# EasyEDA Pro project ProDoc_PCB_SAMID_2026-04-18.epro

# Board PCB_SAMID
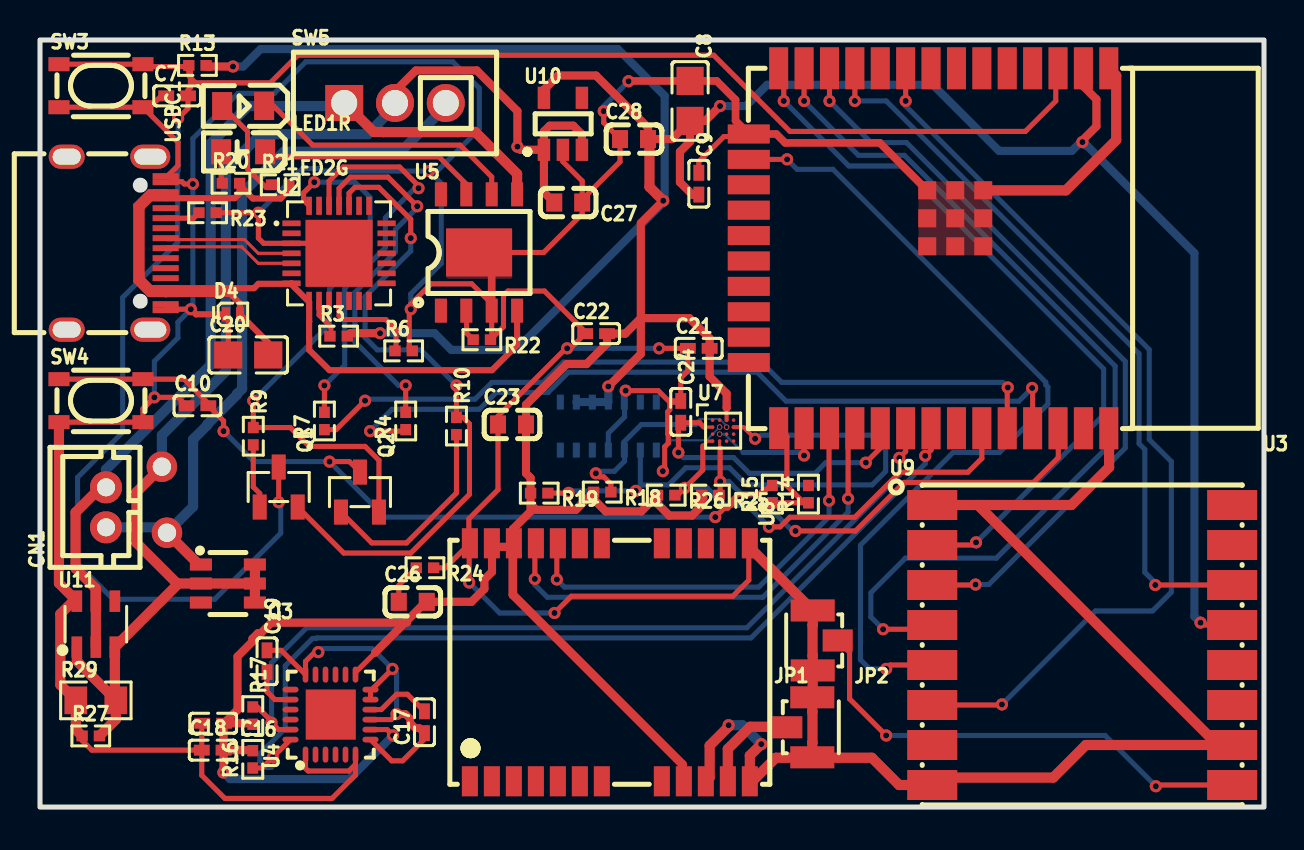
[diagram p0: board, top side]
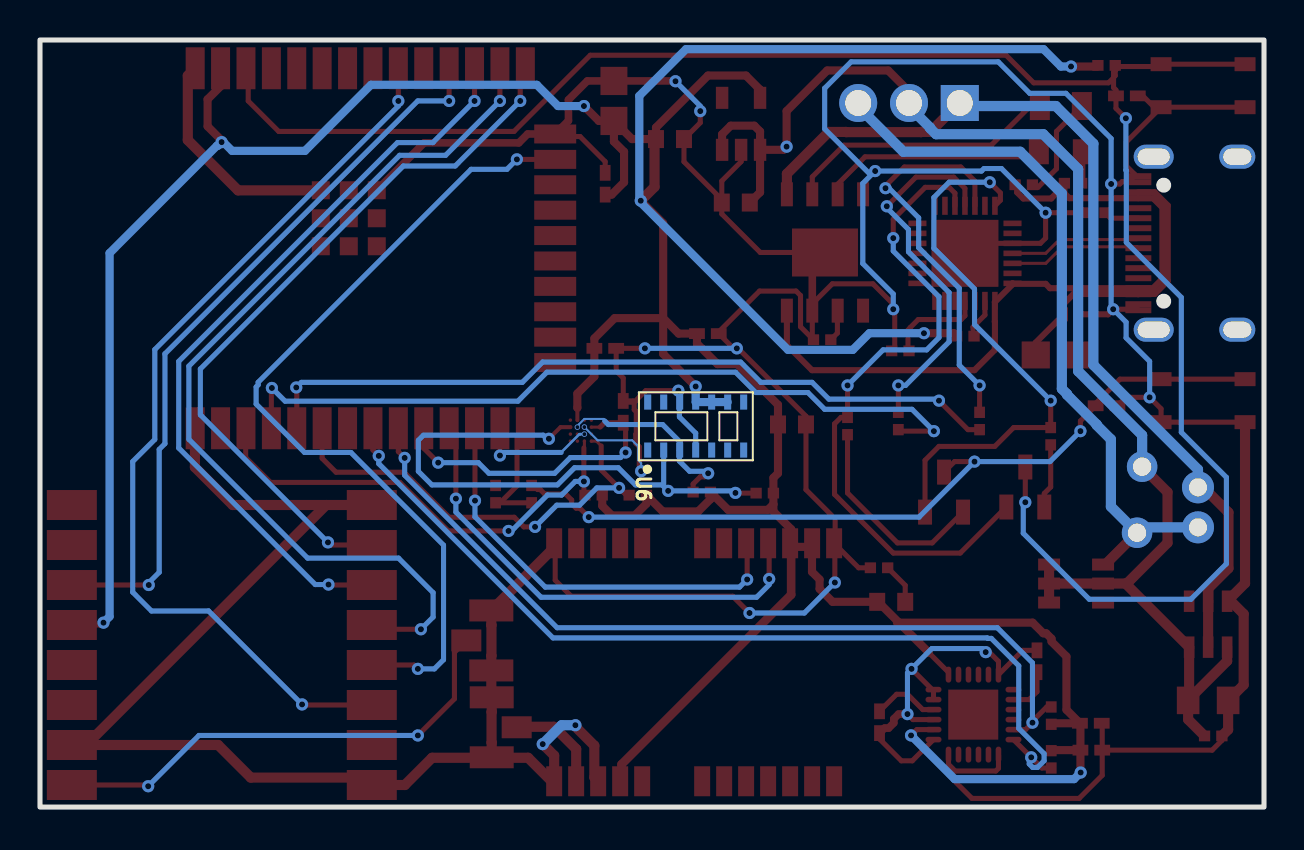
[diagram p1: board, bottom side, seen from below]

Outline 61.21 x 38.35 mm; copper layers: Top Layer, Inner1, Inner2, Bottom Layer. Coordinates in mm from the lower left corner of the outline.
Outline path: rectangle 0,38.35 61.21,0
Stack: Top Layer 0.035mm Outer layer thickness 1oz / Dielectric1 0.2104mm 7628 RC49% 8.6mil / Inner1 0.0152mm Inner layer thickness / Dielectric2 1.065mm 1.1mm H/HOZ Copper / Inner2 0.0152mm Inner layer thickness / Dielectric3 0.2104mm 7628 RC49% 8.6mil / Bottom Layer 0.035mm Outer layer thickness 1oz

## Design rules (mm)
template: User Custom Config
spacing Default (default): track to track 0.254, other pairs 0.254 to 0.254
spacing USB: track to track 0.203, other pairs 0.203 to 0.203
track width Default (default): min 0.102, default 0.305, max 25.4
track width USB: min 0.152, default 0.152, max 2.54
differential pair differentialPair (default): width min 0.127, default 0.254, max 2.54; gap min 0.152, default 0.152
via Default (default): diameter min 0.025, default 0.61, max 100.025; hole min 0.025, default 0.305, max 59.995
net GND uses copperRegion1
net VBUS uses copperRegion1

## Placement (name value [footprint] x y rotation side)
C7  100nF  [C0402]  6.86 35.56 0 top
C8  22uF  [C0805]  32.51 35.31 270 top
C9  100nF  [C0402]  32.95 31.17 270 top
C10  100nF  [C0402]  7.87 20.07 0 top
C16  10nF  [C0402]  8.66 4.19 180 top
C17  100nF  [C0402]  19.23 4.24 90 top
C18  100nF  [C0402]  8.64 2.84 0 top
C19  2.2nF  [C0402]  11.35 7.29 270 top
C20  10uF  [C0805]  10.41 22.61 0 top
C21  100nF  [C0402]  32.94 22.94 0 top
C22  100nF  [C0402]  27.81 23.67 0 top
C23  1uF  [C0603]  23.61 19.13 0 top
C24  100nF  [C0402]  32.05 19.76 270 top
C26  10nF  [C0603]  18.64 10.26 0 top
C27  1uF  [C0603]  26.42 30.23 180 top
C28  1uF  [C0603]  29.71 33.4 0 top
CN1  B2B-PH-K-S(LF)(SN)  [CONN-TH_B2B-PH-K-S]  3.3 14.99 90 top
D4  PESD5V0S1UL,315  [SOD-882_L1.0-W0.6-RD]  9.65 24.64 0 top
JP1  U.FL-R-SMT-1(10)  [ANT-SMD_UFL-R-SMT-1-10]  38 3.99 0 top
JP2  U.FL-R-SMT-1(10)  [ANT-SMD_UFL-R-SMT-1-10]  39.27 8.33 180 top
LED1R  NCD0805R1  [LED0805-R-RD]  10.16 35.05 180 top
LED2G  NCD0805C1  [LED0805-RD]  10.16 32.77 180 top
NOREF  -  [Pad_e405]  6.35 13.72 0 top
NOREF#2  -  [Pad_e539]  6.1 17.02 0 top
Q1  SS8050-G  [SOT-23-3_L2.9-W1.3-P1.90-LS2.4-BR]  11.94 16 270 top
Q2  SS8050-G  [SOT-23-3_L2.9-W1.3-P1.90-LS2.4-BR]  16 15.75 270 top
Q3  FS8205A  [SOT-23-6_L2.9-W1.6-P0.95-LS2.8-BR]  9.4 11.18 180 top
R3  1kΩ  [R0402]  14.94 23.55 0 top
R4  0Ω  [R0402]  18.29 19.3 90 top
R6  10kΩ  [R0402]  18.19 22.81 0 top
R7  0Ω  [R0402]  14.22 19.3 90 top
R9  10kΩ  [R0402]  10.67 18.54 270 top
R10  10kΩ  [R0402]  20.83 19.05 270 top
R13  10kΩ  [R0402]  7.87 37.08 0 top
R14  22Ω  [R0402]  38.43 15.65 90 top
R15  22Ω  [R0402]  36.63 15.65 90 top
R16  4.7kΩ  [R0402]  10.64 2.39 90 top
R17  4.7kΩ  [R0402]  10.64 4.57 270 top
R18  4.7kΩ  [R0402]  28.12 15.75 180 top
R19  4.7kΩ  [R0402]  24.97 15.7 180 top
R20  1kΩ  [R0402]  9.55 31.19 0 top
R21  1kΩ  [R0402]  12.01 31.11 0 top
R22  2.4kΩ  [R0402]  22.1 23.37 180 top
R23  5.1kΩ  [R0402]  8.38 29.72 180 top
R24  0Ω  [R0402]  19.25 11.96 180 top
R25  4.7kΩ  [R0402]  33.53 15.6 180 top
R26  4.7kΩ  [R0402]  31.32 15.6 180 top
R27  1kΩ  [R0402]  2.54 3.56 0 top
R29  1.5kΩ  [R0805]  2.79 5.33 0 top
SW3  PTS810SJM250SMTRLFS  [KEY-SMD_4P-L4.2-W3.2-P2.20-LS4.6]  3.05 36.07 0 top
SW4  PTS810SJM250SMTRLFS  [KEY-SMD_4P-L4.2-W3.2-P2.20-LS4.6]  3.05 20.32 0 top
SW5  5FS1S102M2QES  [SW-TH_5FS1S102M2QES]  17.75 35.2 0 top
U2  CP2102N-A02-GQFN28R  [QFN-28_L5.0-W5.0-P0.50-TL-EP3.3]  14.96 27.69 0 top
U3  ESP32-WROOM-32E(8MB)  [WIFI-SMD_ESP32-WROOM-32E]  44.45 27.94 180 top
U4  MPU-6050_C24112  [QFN-24_L4.0-W4.0-P0.50-TL-EP2.5_B04217]  14.53 4.62 90 top
U5  TP4056-42-ESOP8  [ESOP-8_L4.9-W3.9-P1.27-LS6.0-BL-EP]  21.96 27.73 0 top
U6  MAX30101EFD+T  [OESIP-14_L5.6-W3.3-P0.80-TL]  28.42 19.05 90 bottom
U7  MAX32664GWED+T  [WLP-16_L1.6-W1.6-R4-C4-P0.35-TL_MAX32664GWEA]  34.16 18.82 0 top
U8  NEO-6M  [GPSM-SMD_24P-L16.0-W12.2-P1.10]  28.5 7.24 270 top
U9  915MHz  [COMM-SMD_LORA1276-C1-915MHZ]  52.12 8.1 0 top
U10  AP2112K-3.3TRG1  [SOT-25-5_L2.9-W1.6-P0.95-LS2.8-BL]  26.15 34.16 0 top
U11  DW01A  [SOT-23-6_L2.9-W1.6-P0.95-LS2.8-BL]  2.79 9.14 0 top
USBC1  TYPE-C-31-M-12  [USB-C_SMD-TYPE-C-31-M-12]  3.81 28.19 270 top

## Footprints (pads in the part's own frame, mm; a bottom-side part is the same pattern mirrored in y, then rotated)
ANT-SMD_UFL-R-SMT-1-10
  rect 2.2x1.1 smd: 1(0.625,1.5) 3(0.625,-1.5)
  rect 1.5x1.1 smd: 2(-0.625,0.001)
C0402
  rect 0.79x0.54 smd: 1(-0.545,0) 2(0.545,0)
C0603
  rect 0.8x0.9 smd: 1(-0.7,0) 2(0.7,0)
C0805
  rect 1.41x1.35 smd: 1(-1,0) 2(1,0)
COMM-SMD_LORA1276-C1-915MHZ
  rect 2.5x1.5 smd: 1(-7.5,7) 2(-7.5,5) 3(-7.5,3) 4(-7.5,1) 5(-7.5,-1) 6(-7.5,-3) 7(-7.5,-5) 8(-7.5,-7) 9(7.5,-7) 10(7.5,-5) 11(7.5,-3) 12(7.5,-1) 13(7.5,1) 14(7.5,3) 15(7.5,5) 16(7.5,7)
CONN-TH_B2B-PH-K-S
  round 1.6 hole 0.9: 1(1,0) 2(-1,0)
ESOP-8_L4.9-W3.9-P1.27-LS6.0-BL-EP
  rect 0.6x1.2 smd: 1(-1.905,-2.909) 2(-0.635,-2.909) 3(0.635,-2.909) 4(1.905,-2.909) 5(1.905,2.909) 6(0.635,2.909) 7(-0.635,2.909) 8(-1.905,2.909)
  rect 3.3x2.4 smd: 9(0,0)
GPSM-SMD_24P-L16.0-W12.2-P1.10
  rect 1.5x0.8 smd: 1(5.95,-7) 2(5.95,-5.9) 3(5.95,-4.8) 4(5.95,-3.7) 5(5.95,-2.6) 6(5.95,-1.5) 7(5.95,-0.4) 8(5.95,2.6) 9(5.95,3.7) 10(5.95,4.8) 11(5.95,5.9) 12(5.95,7) 13(-5.95,7) 14(-5.95,5.9) 15(-5.95,4.8) 16(-5.95,3.7) 17(-5.95,2.6) 18(-5.95,-0.4) 19(-5.95,-1.5) 20(-5.95,-2.6) 21(-5.95,-3.7) 22(-5.95,-4.8) 23(-5.95,-5.9) 24(-5.95,-7)
KEY-SMD_4P-L4.2-W3.2-P2.20-LS4.6
  rect 1.05x0.7 smd: 1(-2.1,1.075) 2(2.1,1.075) 3(-2.1,-1.075) 4(2.1,-1.075)
LED0805-R-RD
  rect 1x1.399 smd: 1(1.05,0) 2(-1.05,0)
LED0805-RD
  rect 1x1.25 smd: 1(-1.1,0) 2(1.1,0)
OESIP-14_L5.6-W3.3-P0.80-TL
  rect 0.75x0.35 smd: 1(-1.2,2.4) 2(-1.2,1.6) 3(-1.2,0.8) 4(-1.2,0) 5(-1.2,-0.8) 6(-1.2,-1.6) 7(-1.2,-2.4) 8(1.2,-2.4) 9(1.2,-1.6) 10(1.2,-0.8) 11(1.2,0) 12(1.2,0.8) 13(1.2,1.6) 14(1.2,2.4)
Pad_e405
  round 1.524 hole 0.914: 1(0,0)
Pad_e539
  round 1.524 hole 0.914: 1(0,0)
QFN-24_L4.0-W4.0-P0.50-TL-EP2.5_B04217
  oval 0.8x0.28 smd: 1(-2,1.25) 2(-2,0.75) 3(-2,0.25) 4(-2,-0.25) 5(-2,-0.75) 6(-2,-1.25) 13(2,-1.25) 14(2,-0.75) 15(2,-0.25) 16(2,0.25) 17(2,0.75) 18(2,1.25)
  oval 0.28x0.8 smd: 7(-1.25,-2) 8(-0.75,-2) 9(-0.25,-2) 10(0.25,-2) 11(0.75,-2) 12(1.25,-2) 19(1.25,2) 20(0.75,2) 21(0.25,2) 22(-0.25,2) 23(-0.75,2) 24(-1.25,2)
  rect 2.5x2.5 smd: 25(-0.001,-0.013)
QFN-28_L5.0-W5.0-P0.50-TL-EP3.3
  rect 0.905x0.28 smd: 1(-2.377,1.5) 2(-2.377,1) 3(-2.377,0.5) 4(-2.377,0) 5(-2.377,-0.5) 6(-2.377,-1) 7(-2.377,-1.5) 15(2.377,-1.5) 16(2.377,-1) 17(2.377,-0.5) 18(2.377,0) 19(2.377,0.5) 20(2.377,1) 21(2.377,1.5)
  rect 0.28x0.905 smd: 8(-1.5,-2.377) 9(-1,-2.377) 10(-0.5,-2.377) 11(0,-2.377) 12(0.5,-2.377) 13(1,-2.377) 14(1.5,-2.377) 22(1.5,2.377) 23(1,2.377) 24(0.5,2.377) 25(0,2.377) 26(-0.5,2.377) 27(-1,2.377) 28(-1.5,2.377)
  rect 3.35x3.35 smd: 29(0,0)
R0402
  rect 0.566x0.54 smd: 1(-0.433,0) 2(0.433,0)
R0805
  rect 1.133x1.377 smd: 1(-1,0) 2(1,0)
SOD-882_L1.0-W0.6-RD
  rect 0.4x0.7 smd: 1(-0.35,0) 2(0.35,0)
SOT-23-3_L2.9-W1.3-P1.90-LS2.4-BR
  rect 1.25x0.7 smd: 1(1,-0.95) 2(1,0.95) 3(-1,0)
SOT-23-6_L2.9-W1.6-P0.95-LS2.8-BL
  rect 0.532x1.072 smd: 1(-0.95,-1.149) 2(0,-1.149) 3(0.95,-1.149) 4(0.95,1.149) 5(0,1.149) 6(-0.95,1.149)
SOT-23-6_L2.9-W1.6-P0.95-LS2.8-BR
  rect 1.1x0.6 smd: 1(1.35,-0.95) 2(1.35,0) 3(1.35,0.95) 4(-1.35,0.95) 5(-1.35,0) 6(-1.35,-0.95)
SOT-25-5_L2.9-W1.6-P0.95-LS2.8-BL
  rect 0.623x1.105 smd: 1(-0.95,-1.3) 2(-0.001,-1.3) 3(0.95,-1.3) 4(0.95,1.3) 5(-0.95,1.3)
SW-TH_5FS1S102M2QES
  rect 1.9x1.8 hole 1.3: 1(-2.54,0)
  round 1.9 hole 1.3: 2(0,0) 3(2.54,0)
USB-C_SMD-TYPE-C-31-M-12
  oval 1.2x2 hole 0.8x1.6: 0(-4.325,1.706) 1(4.325,1.706)
  oval 1.2x1.8 hole 0.8x1.4: 2(4.325,-2.474) 3(-4.325,-2.474)
  rect 0.3x1.3 smd: A1(-3.35,2.474) A4(-2.55,2.474) A5(-1.25,2.474) A6(-0.25,2.474) A7(0.25,2.474) A8(1.25,2.474) A9(2.55,2.474) A12(3.35,2.474) B1(3.05,2.474) B4(2.25,2.474) B5(1.75,2.474) B6(0.75,2.474) B7(-0.75,2.474) B8(-1.75,2.474) B9(-2.25,2.474) B12(-3.05,2.474)
WIFI-SMD_ESP32-WROOM-32E
  rect 0.95x2.1 smd: 1(-9.002,-9) 2(-7.732,-9) 3(-6.463,-9) 4(-5.192,-9) 5(-3.922,-9) 6(-2.652,-9) 7(-1.383,-9) 8(-0.113,-9) 9(1.157,-9) 10(2.428,-9) 11(3.697,-9) 12(4.968,-9) 13(6.237,-9) 14(7.508,-9) 25(7.508,9) 26(6.237,9) 27(4.968,9) 28(3.697,9) 29(2.428,9) 30(1.157,9) 31(-0.113,9) 32(-1.383,9) 33(-2.652,9) 34(-3.922,9) 35(-5.192,9) 36(-6.463,9) 37(-7.732,9) 38(-9.002,9)
  rect 2.1x0.95 smd: 15(9.002,-5.715) 16(9.002,-4.445) 17(9.002,-3.175) 18(9.002,-1.905) 19(9.002,-0.635) 20(9.002,0.635) 21(9.002,1.905) 22(9.002,3.175) 23(9.002,4.445) 24(9.002,5.715)
  rect 0.9x0.9 smd: 39(-2.721,-0.1) 39(-2.721,-1.5) 39(-2.721,-2.9) 39(-1.321,-0.1) 39(-1.321,-1.5) 39(-1.321,-2.9) 39(0.079,-0.1) 39(0.079,-1.5) 39(0.079,-2.9)
WLP-16_L1.6-W1.6-R4-C4-P0.35-TL_MAX32664GWEA
  round 0.176 smd: A1(-0.525,0.525) A2(-0.175,0.525) A3(0.175,0.525) A4(0.525,0.525) B1(-0.525,0.175) B2(-0.175,0.175) B3(0.175,0.175) B4(0.525,0.175) C1(-0.525,-0.175) C2(-0.175,-0.175) C3(0.175,-0.175) C4(0.525,-0.175) D1(-0.525,-0.525) D2(-0.175,-0.525) D3(0.175,-0.525) D4(0.525,-0.525)

## Nets
+3V3: C8.2 C9.2 C16.1 C18.2 C21.2 C22.2 C23.2 C26.2 C28.2 R3.2 R13.2 R16.2 R17.2 R18.2 R19.2 R25.2 R26.2 U3.2 U4.8 U4.13 U6.9 U6.10 U6.11 U7.A3 U8.9 U8.22 U8.23 U9.13 U10.5
-VBAT_PROTECTED: C27.2 NOREF#2.1 Q3.2 Q3.4 Q3.5 Q3.6 R27.2 R29.2 SW5.2 U10.1 U10.3 U11.1 U11.3
GND: C7.1 C8.1 C9.1 C10.1 C16.2 C17.1 C18.1 C19.1 C20.1 C21.1 C22.1 C23.1 C24.1 C27.1 C28.1 D4.1 JP1.1 JP1.3 JP2.1 JP2.3 R6.2 R22.1 R23.1 R24.1 R27.1 R29.1 SW3.3 SW3.4 SW4.3 SW4.4 U2.3 U2.29 U3.1 U3.15 U3.38 U3.39 U4.1 U4.6 U4.7 U4.9 U4.11 U4.12 U4.18 U5.3 U5.9 U6.4 U6.12 U7.B2 U8.10 U8.12 U8.13 U8.24 U9.1 U9.8 U9.10 U10.2 U11.6 USBC1.A1 USBC1.A12 USBC1.B1 USBC1.B12
VBAT: CN1.1 SW5.1 U5.5 U11.2 U11.5
VBUS: R20.2 R21.2 U2.7 U2.8 U5.4 USBC1.B4 USBC1.B9
-BATT: CN1.2 NOREF.1 Q3.1 SW5.3
DIO0_LORA: U3.11 U9.14
DTR: Q2.2 R9.1 U2.28
EN: C7.2 Q1.3 R13.1 SW3.1 SW3.2 U3.3
I34: U3.6
I35: U3.7
I36: U3.4
I39: U3.5
IO0: R14.1 R15.1 U3.25
IO0_BTN: C10.2 Q2.3 R15.2 SW4.1 SW4.2
IO0_CON: R14.2
IO2: U3.24
IO4: U3.26 U7.C2
IO5: C24.2 U3.29 U7.B1
IO15: U3.23
IO23: U3.37
IO25: U3.10
IO32: U3.8
MISO_LORA: U3.14 U9.2
MOSI_LORA: U3.12 U9.3
NRESET_LORA: U3.9 U9.6
NSS_LORA: U3.16 U9.5
RTS: Q1.2 R10.1 U2.24
RXD: R4.2 U2.25
RXD0: R7.1 U3.34
RXD1: U3.28 U8.21
SCK_LORA: U3.13 U9.4
SCL_MAX: R26.1 U3.33 U7.D1
SCL_MAX30101: R19.1 U6.2 U7.B4
SCL_MPU: R17.1 U3.30 U4.23
SDA_MAX: R25.1 U3.36 U7.D2
SDA_MAX30101: R18.1 U6.3 U7.B3
SDA_MPU: R16.1 U3.31 U4.24
TXD: R7.2 U2.26
TXD0: R4.1 U3.35
TXD1: U3.27 U8.20
USB_DN: U2.5 USBC1.A7
USB_DP: U2.4 USBC1.A6
$1N40: R3.1 U2.9
$1N41: R6.1 U2.11
$1N56: Q1.1 R9.2
$1N57: Q2.1 R10.2
$1N121: C17.2 U4.10
$1N125: C19.2 U4.20
$1N9186: C20.2 D4.2 USBC1.A4 USBC1.A9
$1N10519: LED2G.2 R20.1
$1N10763: LED1R.1 R21.1
$1N10787: LED2G.1 U5.7
$1N10793: LED1R.2 U5.6
$1N10830: R22.2 U5.2
$1N11085: R23.2 USBC1.A5
$1N12820: JP1.2 U8.11
$1N12987: C26.1 R24.2
$1N13410: JP2.2 U9.9
$1N21665: Q3.3

Pads without a net: U2 1 2 6 10 12 13 14 15 16 17 18 19 20 21 22 23 27; U3 17 18 19 20 21 22 32; U4 2 3 4 5 14 15 16 17 19 21 22 25; U5 1 8; U6 1 5 6 7 8 13 14; U7 A1 A2 A4 C1 C3 C4 D3 D4; U8 1 2 3 4 5 6 7 8 14 15 16 17 18 19; U9 7 11 12 15 16; U10 4; U11 4; USBC1 0 1 2 3 A8 B5 B6 B7 B8

## Via types
v1: diameter 0.61, hole 0.305, Top Layer to Bottom Layer, 79 vias
v2: diameter 0.275, hole 0.2, Top Layer to Bottom Layer, 3 vias

## Routing (per net, layer and track width the routed paths; a pad name or vN(x,y) marks a point on that pad's centre or on a via; arc(x,y) is an arc through that point)
+3V3: length 224.5
  Top Layer w0.203: 34.34,19.96 U7.A3
  Top Layer w0.254: U4.8 17.36,3.87 v1(17.65,3.58) ; U4.13 15.78,6.74 16.76,7.72 ; U9.13 58.16,9.1 v1(58.04,9.22)
  Top Layer w0.406: C16.1 9.88,4.87 9.88,7.53 10.63,8.28 10.63,8.42 10.89,8.69 11.04,8.69 11.57,9.22 18.25,9.22 ; C16.1 10.59,4.19 10.64,4.14 ; C16.1 9.18,4.17 C18.2 ; 18.25,9.22 16.76,7.73 16.76,7.72 ; 18.25,9.22 18.36,9.22 ; 18.25,9.22 19.3,10.26 C26.2 21.58,10.26 22.22,10.91 22.22,11.38 22.61,11.76 22.61,13.01 ; 52.18,36.43 52.18,36.04 52.83,35.39 52.83,34.04 52.13,33.34 v1(52.13,33.25) ; 22.61,13.01 22.61,13.18 22.6,13.19 ; 22.61,13.01 23.65,13.01 23.65,13.9 24.54,14.78 24.54,15.14 ; v1(31.17,30.32) 30.05,29.2 30.05,24.45 ; R25.2 33.09,15.06 32.61,14.58 31.47,14.58 30.89,15.16 R26.2 30.07,14.78 28.3,14.78 27.69,15.39 R18.2 26.8,14.86 24.82,14.86 24.54,15.14 ; v1(28.42,21.03) 30.05,22.66 30.05,24.45 ; C18.2 10.61,2.84 R16.2 ; C18.2 9.18,1.74 v1(9.17,1.73) ; 24.54,15.14 R19.2 24.54,16.46 24.31,16.69 C23.2 24.31,20.12 26.34,22.15 27.33,22.15 28.36,23.18 C22.2 29.27,23.67 30.05,24.45 ; 32.95,30.62 32.62,30.62 32,31.24 32,32.77 32.51,33.27 C8.2 ; 30.05,24.45 32.47,24.45 33.49,23.43 C21.2 33.49,21.53 34.34,20.68 34.34,19.97 34.34,19.96 ; R3.2 15.51,23.69 v1(17.01,23.69) ; C8.2 33.26,34.31 v1(34.01,35.05) ; C8.2 31.61,33.4 C28.2 30.41,33.98 27.81,36.58 25.91,36.58 25.2,35.87 U10.5 ; 8.31,37.08 8.36,37.03 v1(9.65,37.03)
  Top Layer w0.432: 32.15,1.11 32.13,1.13 32.13,2.13 23.65,10.62 23.65,13.01
  Top Layer w0.508: 30.48,33.27 30.48,31.01 v1(31.17,30.32)
  Bottom Layer w0.406: v1(17.01,23.69) 19.73,23.69 20.57,22.86 23.8,22.86 31.24,30.3 ; v1(9.17,1.73) 9.5,1.4 15.47,1.4 v1(17.65,3.58) ; v1(28.42,21.03) U6.11 U6.10 U6.9 ; v1(9.65,37.03) 10.16,37.03 11.03,37.9 28.91,37.9 31.24,35.56 31.24,30.39 ; v1(58.04,9.22) 57.73,9.53 57.73,27.7 52.36,33.07 52.31,33.07 v1(52.13,33.25) 52.04,33.25 51.61,32.81 47.96,32.81 44.66,36.11 36.37,36.11 35.31,35.05 v1(34.01,35.05)
-VBAT_PROTECTED: length 69.6
  Top Layer w0.406: U10.3 27.1,33.64 26.67,34.07 25.49,34.07 25.2,33.78 U10.1 ; C27.2 25.2,30.74 U10.1 ; U10.1 24.03,32.86 v1(23.88,33.02) 23.88,34.8 21.84,36.83 18.8,36.83 17.78,35.81 17.78,35.05
  Top Layer w0.508: 6.93,11.18 U11.3 3.74,5.4 1.84,7.3 U11.1 ; 6.93,11.18 6.86,11.18 4.83,13.21 4.83,15.75 NOREF#2.1 ; 6.93,11.18 Q3.2 Q3.5 ; R27.2 3.79,4.38 R29.2 ; Q3.5 Q3.4 ; Q3.5 Q3.6
  Bottom Layer w0.508: NOREF#2.1 6.1,18.59 9.3,21.79 9.3,31.9 11.04,33.64 16.4,33.64 16.7,33.94 16.7,33.97 17.78,35.05
GND: length 344.9
  Top Layer w0.254: U4.11 U4.12 16.59,5.87 v1(17.63,6.91) ; 6.47,31.54 6.74,31.28 7.09,31.28 7.21,31.16 v1(7.65,31.16) ; 6.47,31.54 6.47,31.65 6.9,32.07 6.9,33.24 SW3.4 ; 6.47,31.54 USBC1.A1 ; 31.5,20.24 31.5,19.87 31.39,19.77 31.39,18.66 31.42,18.64 31.42,18.19 31.24,18.01 31.24,16.89 v1(31.15,16.79) ; 31.5,20.24 31.98,20.24 C24.1 ; 31.5,20.24 30.92,20.82 v1(29.29,20.82) ; 31.5,20.24 31.56,20.31 C24.1 ; SW3.4 5.49,34.99 6.06,35.56 C7.1 ; SW3.4 SW3.3 ; 21.45,13.14 21.45,14.41 22.91,15.87 C23.1 22.91,19.54 26.3,22.94 v1(26.37,22.94) 26.53,22.94 C22.1 27.27,23.76 25.23,25.8 23.4,25.8 23.18,25.58 23.18,24.02 22.59,23.43 ; 21.45,13.14 21.5,13.19 ; 21.45,13.14 20.27,11.96 R24.1 ; 21.45,13.14 21.45,13.01 21.46,13 v1(21.46,11.23) ; C10.1 6.91,20.49 v1(5.72,20.49) 5.15,19.91 SW4.4 SW4.3 ; C19.1 12.07,7.83 U4.18 13.28,7.28 13.74,7.75 v1(13.92,7.75) ; R23.1 v1(10.92,29.72) 10.92,28.45 11.18,28.19 U2.3 14.46,28.19 U2.29 ; C9.1 32.95,32.27 34.2,33.53 35.32,33.53 U3.15 ; U5.9 25.19,27.73 27.12,29.66 27.12,30.37 ; C16.2 8.09,4.17 C18.1 ; 15.78,2.14 15.44,1.8 13.41,1.8 13.28,1.94 U4.1 ; 15.78,2.14 15.78,1.61 14.61,0.43 9.25,0.43 8.09,1.59 C18.1 ; 15.78,2.14 U4.6 ; v1(7.54,24.89) 6.33,24.89 USBC1.A12 ; v1(30.96,22.94) 32.4,22.94 32.4,21.81 32.05,21.45 C24.1 ; U4.9 17.56,4.37 v1(17.83,4.65) ; 22.59,23.43 R22.1 ; 22.59,23.43 U5.3 ; 35.45,12.83 35.45,11.34 34.65,10.54 26.57,10.54 v1(25.73,9.7) ; R27.1 2.11,3.33 2.59,2.84 C18.1 ; 27.12,30.37 29.01,32.27 C28.1 28.19,34.21 v1(28.19,34.8) ; 27.12,30.37 27.12,31.3 26.15,32.27 U10.2 ; 22.59,25.16 21.59,26.16 19.56,26.16 18.54,25.15 v1(18.54,24.89) 18.47,24.82 18.47,22.96 18.62,22.81 ; U4.7 17.59,2.31 18.14,2.31 19.23,3.4 C17.1 ; D4.1 9.41,24.53 C20.1
  Top Layer w0.305: D4.1 7.8,24.64 v1(7.54,24.89)
  Top Layer w0.381: 22.59,25.16 22.59,27.09 U5.9 ; C17.1 18.98,3.95 18.77,3.95 18.51,4.21 18.51,4.41 18.28,4.65 v1(17.83,4.65) ; U3.39 42,33.21 37.27,33.21 36.82,33.66 U3.15 34.79,34.32 34.79,35.36 33.84,36.31 C8.1 29.45,36.31 v1(29.43,36.29)
  Top Layer w0.508: U3.1 53.82,36.57 53.82,33.35 51.31,30.84 47.18,30.84 U3.39 ; U5.3 22.59,25.16 ; 35.45,12.83 35.45,13.01 35.46,13.01 JP2.3 38.64,9.1 38.64,9.09 38.64,7.57 38.64,7.56 JP2.1 38.64,5.51 JP1.1 38.62,4.76 38.63,4.75 38.63,3.23 38.62,3.22 JP1.3 ; U8.12 35.5,2.57 v1(36.07,3.15) ; R27.1 1.79,3.87 R29.1 1.02,6.11 1.02,9.65 1.66,10.29 1.84,10.29 0.95,11.19 SW4.3 ; 46.9,15.1 51.58,15.1 53.47,16.99 53.47,18.93 U3.38 ; 46.9,15.1 U9.1 ; 46.9,15.1 58.9,3.1 ; 35.45,1.11 36.8,2.46 41.61,2.46 42.97,1.1 U9.8 44.99,1.47 50.67,1.47 52.3,3.1 58.9,3.1 ; 58.9,3.1 U9.10 ; U8.10 33.49,1.48 33.49,3.07 34.44,4.02 v1(34.44,4.09)
  Bottom Layer w0.102: v1(31.15,16.79) 31.15,17.2 31.3,17.35 31.3,18.04 31.6,18.34 33.33,18.34 v2(33.99,19)
  Bottom Layer w0.254: 19.57,31.67 v1(19.45,31.8) 14.13,31.8 14,31.93 13.13,31.93 v1(10.92,29.72) ; 19.57,31.67 19.74,31.67 21.97,33.91 21.97,35.94 20.65,37.26 13.29,37.26 11.72,35.69 9.91,35.69 7.65,33.43 v1(7.65,31.16) 7.65,24.99 v1(7.54,24.89) 6.9,24.25 6.9,23.46 5.72,22.29 v1(5.72,20.49) ; 19.57,31.67 20.07,31.18 20.07,27.18 18.54,25.65 v1(18.54,24.89) ; v1(28.19,34.8) 28.19,35.05 v1(29.43,36.29) ; v1(17.83,4.65) 17.83,6.71 v1(17.63,6.91) 16.61,7.92 14.1,7.92 v1(13.92,7.75) ; v1(29.29,20.82) 29.24,20.77 29.24,19.51 28.42,18.69 U6.4 ; v1(30.96,22.94) v1(26.37,22.94) ; v1(21.46,11.23) 22.99,9.7 v1(25.73,9.7)
  Bottom Layer w0.508: v1(36.07,3.15) 35.12,4.09 v1(34.44,4.09)
VBAT: length 47.1
  Top Layer w0.508: CN1.1 3.03,15.99 1.78,14.73 1.78,11.94 2.79,10.92 U11.2 ; 23.86,30.64 23.86,31.66 21.77,33.76 20.91,33.76 20.9,33.75 17.15,33.75 17.14,33.76 16.69,33.76 15.39,35.05 15.24,35.05
  Bottom Layer w0.508: CN1.1 3.3,16.88 8.53,22.11 8.53,33.17 10.41,35.05 15.24,35.05
VBUS: length 36.7
  Top Layer w0.305: U5.4 23.86,23.1 22.61,21.84 14.48,21.84 13.46,22.86 13.46,23.48 13.46,23.48 13.46,24.27 13.46,24.28 13.46,25.25 12.58,26.13 U2.7 12.56,26.16 10.92,26.16 10.7,25.94 USBC1.B4 5.55,25.94 5.08,26.42 5.08,29.97 5.55,30.44 USBC1.B9 9.74,30.44 9.98,30.69 9.98,31.09 10.64,30.43 12.04,30.43 12.34,30.73 12.34,30.96 12.37,30.99
-BATT: length 36.1
  Top Layer w0.508: NOREF.1 7.94,12.13 Q3.1
  Bottom Layer w0.508: 20.32,35.05 18.03,32.77 12.19,32.77 10.11,30.68 10.11,20.91 9.86,20.66 9.86,20.62 8.37,19.13 8.37,19.1 7.66,18.39 7.66,15.02 NOREF.1 6.08,13.99 CN1.2
DIO0_LORA: length 36.8
  Top Layer w0.254: U3.11 v1(40.75,35.31) ; U9.14 v1(55.78,11.1)
  Bottom Layer w0.254: v1(55.78,11.1) 55.78,11.21 55.25,11.74 55.25,17.88 54.97,18.17 54.97,22.66 42.32,35.31 40.76,35.31 v1(40.75,35.31)
DTR: length 28.1
  Top Layer w0.254: v1(13.72,31.24) 13.18,30.71 13.18,30.34 13.46,30.06 ; v1(10.67,20.32) R9.1 12.52,18.97 13.46,18.03 16.26,18.03 16.95,17.34 Q2.2
  Bottom Layer w0.254: v1(13.72,31.24) 15.75,31.24 16.51,30.48 16.51,27.94 14.48,25.91 14.48,24.13 v1(10.67,20.32)
EN: length 97.2
  Top Layer w0.254: 7.52,36.47 7.52,36.49 ; 7.52,36.47 7.52,35.97 7.4,35.85 C7.2 7.4,34.94 v1(6.91,34.44) ; 7.52,36.47 7.78,36.21 11.52,36.21 12.9,37.59 33.7,37.59 37.51,33.78 49.28,33.78 50.8,35.31 50.8,36.32 50.91,36.43 ; 7.52,36.49 7.44,36.57 7.44,36.83 ; 7.52,36.49 7.52,36.75 7.44,36.83 ; R13.1 7.44,36.83 ; 7.44,36.83 7.24,37.03 5.26,37.03 SW3.2 SW3.1 ; Q1.3 v1(11.94,15.24)
  Bottom Layer w0.254: v1(6.91,34.44) 6.91,31.85 6.89,31.83 6.89,28.23 4.14,25.48 4.14,18.74 1.88,16.48 1.88,12.17 3.66,10.39 8.74,10.39 12.04,13.69 12.04,15.14 v1(11.94,15.24)
IO0: length 6.1
  Top Layer w0.254: 36.58,15.31 36.68,15.21 38.2,15.21 ; 38.2,15.21 R14.1 ; 38.2,15.21 37.36,16.06 37.36,18.53 U3.25
IO0_BTN: length 41.4
  Top Layer w0.254: v1(14.48,17.27) 15.48,17.27 Q2.3 ; SW4.1 SW4.2 7.2,21.39 8.42,20.18 C10.2 9.18,19.3 v1(9.18,18.8) ; 36.58,16.18 36.58,16.13 36.33,15.88 36.2,15.88 35.98,15.65 34.93,15.65 34.62,15.35 34.62,15.17 34.4,14.94 34.22,14.94 v1(33.77,14.5)
  Bottom Layer w0.254: v1(33.77,14.5) 17.25,14.5 v1(14.48,17.27) 10.71,17.27 v1(9.18,18.8)
IO4: length 6
  Top Layer w0.254: U3.26 v1(38.21,17.58)
  Bottom Layer w0.127: v2(33.99,18.65) 34.19,18.65 34.19,18.64 34.24,18.64 35.15,17.73
  Bottom Layer w0.254: 35.15,17.73 38.06,17.73 v1(38.21,17.58)
IO5: length 15.3
  Top Layer w0.152: 33.2,19 U7.B1
  Top Layer w0.254: v1(41.3,17.22) 42.02,17.94 U3.29 ; 33.2,19 32.98,19.22 C24.2 31.93,19.1 v1(31.93,17.73)
  Bottom Layer w0.254: v1(41.3,17.22) 39.29,17.22 38.76,16.69 35.48,16.69 34.69,17.47 32.18,17.47 v1(31.93,17.73)
MISO_LORA: length 36.8
  Top Layer w0.254: U3.14 37.2,36.69 v1(37.2,35.31) ; U9.2 46.68,13.1 v1(46.81,13.23)
  Bottom Layer w0.254: v1(37.2,35.31) 40.45,32.05 43.04,32.05 53.19,21.9 53.19,19.61 v1(46.81,13.23)
MOSI_LORA: length 38.6
  Top Layer w0.254: v1(46.79,11.12) 46.76,11.1 U9.3 ; U3.12 v1(39.48,35.31)
  Bottom Layer w0.254: v1(46.79,11.12) 47.45,11.12 54.28,17.95 54.28,22.28 43.34,33.22 41.57,33.22 v1(39.48,35.31)
NRESET_LORA: length 46
  Top Layer w0.254: v1(48.11,5.13) 48.08,5.1 U9.6 ; U3.9 v1(43.29,35.31)
  Bottom Layer w0.254: v1(43.29,35.31) 43.29,35.05 55.47,22.87 55.47,18.38 56.58,17.28 56.58,10.74 55.64,9.8 52.78,9.8 v1(48.11,5.13)
NSS_LORA: length 42.5
  Top Layer w0.254: U3.16 v1(37.36,32.39) ; v1(42.32,6.91) 42.51,7.1 U9.5
  Bottom Layer w0.254: v1(42.32,6.91) 41.49,6.91 41.03,7.37 41.03,13.1 45.66,17.73 47.98,17.73 50.41,20.15 50.41,21.01 50.3,21.11 50.3,21.24 39.65,31.89 37.86,31.89 v1(37.36,32.39)
RTS: length 33.6
  Top Layer w0.254: Q1.2 15.19,12.7 18.54,12.7 21.48,15.64 21.48,19.16 21.16,19.48 R10.1 v1(20.83,21.08) ; v1(18.54,28.45) 18.54,29.39 16.94,30.99 15.75,30.99 15.46,30.7 15.46,30.06
  Bottom Layer w0.254: v1(20.83,21.08) 19.05,22.86 16.87,22.86 16.26,23.47 16.26,25.52 18.54,27.8 v1(18.54,28.45)
RXD: length 18.5
  Top Layer w0.254: v1(18.86,30.04) 17.41,31.5 15.52,31.5 14.96,30.93 U2.25 ; 18.29,19.74 v1(18.29,21.08)
  Bottom Layer w0.254: v1(18.86,30.04) 18.86,29.96 17.78,28.88 17.78,27.76 15.75,25.73 15.75,23.26 17.93,21.08 v1(18.29,21.08)
RXD0: length 38.2
  Top Layer w0.254: R7.1 14.81,18.87 v1(16.26,20.32) ; v1(48.4,20.98) 48.37,20.95 U3.34
  Bottom Layer w0.254: v1(16.26,20.32) 16.33,20.39 21.76,20.39 22.6,21.23 25.16,21.23 26.18,22.25 36.08,22.25 37.09,21.23 48.14,21.23 v1(48.4,20.98)
RXD1: length 23.9
  Top Layer w0.254: 24.75,13.01 v1(24.75,11.4) ; U3.28 40.41,18.6 v1(40.41,15.42)
  Bottom Layer w0.254: v1(40.41,15.42) 40.41,14.75 36.16,10.49 25.37,10.49 24.75,11.12 v1(24.75,11.4)
SCK_LORA: length 46.4
  Top Layer w0.254: U3.13 v1(38.21,35.31) ; U9.4 44.41,8.89 v1(42.16,8.89)
  Bottom Layer w0.254: v1(38.21,35.31) 40.93,32.59 43.23,32.59 53.77,22.05 53.77,18.39 47.83,12.45 43.28,12.45 41.55,10.72 41.55,9.5 v1(42.16,8.89)
SCL_MAX: length 22.3
  Top Layer w0.152: U7.D1 33.38,18.3 33.15,18.06
  Top Layer w0.254: U3.33 47.1,17.44 46.41,16.74 43,16.74 40.75,14.49 37.5,14.49 37.02,14.01 v1(36.46,14.01) ; 31.75,15.6 31.89,15.6 v1(32.25,15.96) 33.15,16.85 33.15,18.06
  Bottom Layer w0.254: v1(36.46,14.01) 35.37,15.09 34.23,15.09 33.37,15.96 v1(32.25,15.96)
SCL_MAX30101: length 29.5
  Top Layer w0.203: U7.B4 35.18,19 v1(35.76,18.41)
  Top Layer w0.254: v1(26.43,15.71) 26.42,15.7 R19.1
  Bottom Layer w0.254: v1(35.76,18.41) 35.79,18.39 35.84,18.39 36.04,18.59 42.04,18.59 42.29,18.34 42.29,16.78 41.61,16.11 35.34,16.11 34.48,16.97 32.29,16.97 31.43,16.11 30.1,16.11 v1(29.8,15.81) 26.54,15.81 v1(26.43,15.71) ; 30.02,16.03 U6.2
SCL_MPU: length 43.2
  Top Layer w0.254: U4.23 11.93,3.87 v1(11.58,4.22) 11.58,4.29 10.87,5 R17.1 ; v1(42.98,17.46) 43.29,17.78 U3.30
  Bottom Layer w0.254: v1(42.98,17.46) 42.98,16.59 35.35,8.97 13.34,8.97 11.58,7.21 v1(11.58,4.22)
SDA_MAX: length 23.7
  Top Layer w0.152: U7.D2 33.99,17.98 34.01,17.96
  Top Layer w0.254: 34.04,15.6 34.01,15.62 v1(34.01,16.28) 34.01,17.96 ; v1(37.78,13.81) 40.78,13.81 43.21,16.23 49.69,16.23 50.93,17.47 50.93,18.93 U3.36
  Bottom Layer w0.254: v1(37.78,13.81) 37.63,13.81 35.83,15.6 35.13,15.6 34.45,16.28 v1(34.01,16.28)
SDA_MAX30101: length 9.5
  Top Layer w0.254: R18.1 28.55,16.15 28.19,16.51 27.98,16.51 v1(27.8,16.69)
  Bottom Layer w0.102: 32.97,19.3 32.97,19.36 33.02,19.41 33.99,19.41 34.28,19.12 34.28,19.06 v2(34.34,19)
  Bottom Layer w0.254: 32.97,19.3 32.79,19.13 30.08,19.13 29.19,18.24 ; U6.3 29.24,17.84 29.24,17.3 28.73,16.79 27.9,16.79 v1(27.8,16.69)
SDA_MPU: length 47.2
  Top Layer w0.254: v1(44.27,17.56) 44.56,17.85 U3.31 ; R16.1 11.11,1.95 v1(11.64,2.49) U4.24
  Bottom Layer w0.254: v1(11.64,2.49) 11.74,2.39 11.74,2.15 11.57,1.98 11.33,1.98 11,2.31 11,2.67 12.27,3.93 12.27,7.06 13.63,8.43 13.82,8.43 13.84,8.46 35.56,8.46 44.27,17.17 v1(44.27,17.56)
TXD: length 19.8
  Top Layer w0.254: v1(18.93,30.94) 18.93,31.06 17.98,32 15.16,32 14.46,31.3 14.46,30.06 ; 14.22,19.74 v1(14.22,21.08)
  Bottom Layer w0.254: v1(14.22,21.08) 15.24,22.1 15.24,25.94 17.27,27.97 17.27,29.46 18.75,30.94 v1(18.93,30.94)
TXD0: length 39
  Top Layer w0.254: v1(16.51,18.8) 18.21,18.8 R4.1 ; U3.35 49.64,20.93 v1(49.62,20.95)
  Bottom Layer w0.254: v1(16.51,18.8) 17.6,19.89 21.97,19.89 22.81,20.73 25.41,20.73 26.43,21.74 35.86,21.74 37.31,20.29 48.96,20.29 v1(49.62,20.95)
TXD1: length 21.3
  Top Layer w0.254: 25.85,13.01 v1(25.85,11.38) ; U3.27 39.46,18.92 v1(39.46,15.32)
  Bottom Layer w0.254: v1(25.85,11.38) 26.23,11 35.94,11 39.46,14.51 v1(39.46,15.32)
USB_DN: length 6.7
  Top Layer w0.152: USBC1.A7 6.35,28.01 10.09,28.01 10.91,27.19 U2.5
USB_DP: length 6.6
  Top Layer w0.152: USBC1.A6 6.35,28.37 10.23,28.37 10.92,27.69 U2.4
$1N40: length 1.7
  Top Layer w0.254: 14.55,23.88 14.55,24 13.96,24.6 U2.9
$1N41: length 5
  Top Layer w0.254: 17.8,22.86 R6.1 ; U2.11 14.96,24.57 15.14,24.38 17.29,24.38 17.69,23.98 17.69,23.96 17.81,23.85 17.81,22.86
$1N56: length 3.2
  Top Layer w0.254: Q1.1 10.99,15.68 10.67,16 R9.2
$1N57: length 10.4
  Top Layer w0.254: Q2.1 16.59,13.21 18.33,13.21 20.83,15.7 R10.2
$1N121: length 3.4
  Top Layer w0.254: C17.2 18.38,5.64 17.83,5.64 17.06,4.87 U4.10
$1N125: length 2.3
  Top Layer w0.254: U4.20 11.75,5.37 11.35,5.77 C19.2
$1N9186: length 14.3
  Top Layer w0.305: USBC1.A4 5.47,30.74 4.81,30.08 4.81,26.31 5.46,25.65 6.27,25.65 USBC1.A9 6.29,25.65 9.53,25.65 10,25.18 D4.2 11.41,23.23 C20.2
$1N10519: length 1.6
  Top Layer w0.254: 9.17,31.19 9.06,31.3 LED2G.2
$1N10763: length 5.2
  Top Layer w0.254: 11.5,30.99 11.3,30.99 10.38,31.91 10.38,33.78 LED1R.1
$1N10787: length 11.2
  Top Layer w0.254: LED2G.1 11.51,32.51 19.95,32.51 21.32,31.14 21.32,30.64
$1N10793: length 13.7
  Top Layer w0.254: LED1R.2 11.68,35.05 13.64,33.1 21.01,33.1 22.59,31.51 22.59,30.64
$1N10830: length 1.6
  Top Layer w0.254: R22.2 21.34,23.7 21.34,24.8 U5.2
$1N11085: length 1.8
  Top Layer w0.254: R23.2 7.68,29.44 USBC1.A5
$1N12820: length 5.2
  Top Layer w0.508: 37.47,4.01 35.51,4.01 34.4,2.9 U8.11
$1N12987: length 2.1
  Top Layer w0.254: R24.2 17.94,11.09 C26.1
$1N13410: length 24.1
  Top Layer w0.254: JP2.2 40.49,7.74 40.49,5.41 v1(42.32,3.58) ; v1(55.8,1.04) 55.87,1.1 U9.9
  Bottom Layer w0.254: v1(55.8,1.04) 53.27,3.58 v1(42.32,3.58)

## Copper pours and planes (outline as drawn; the poured copper is in the pictures)
GND on Top Layer: 13.28,29.36 16.58,29.36 16.58,26.06 13.28,26.06
GND on Top Layer: 43.93,31.28 47.62,31.28 47.62,27.59 43.93,27.59
GND on Top Layer: 20.32,28.96 23.62,28.96 23.62,26.42 20.32,26.42
GND on Inner1: 0.16,38.2 61.06,38.2 61.06,0.16 0.16,0.16
GND on Inner2: 20.79,35.53 22.01,35.53 22.01,34.57 20.79,34.57
GND on Inner2: 19.84,34.58 20.8,34.58 20.8,33.37 19.84,33.37
GND on Inner2: 0.16,37.69 95.6,37.69 95.6,-19.4 0.16,-19.4
GND on Inner2: 19.84,36.74 20.8,36.74 20.8,35.52 19.84,35.52

Small or netless copper shapes (teardrops, artwork), in the pictures only: 3 on Inner2
